# Altium schematic sheet 车架.schdoc
size 112 x 32 mm
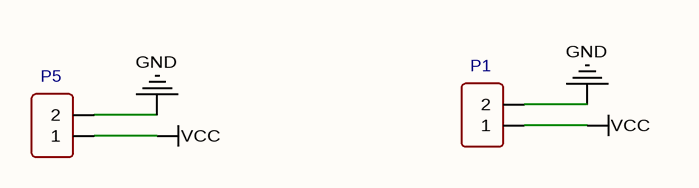
[diagram p0: 车架.schdoc]

## Parts
P1  Header-Female-2.54_1x2  [HDR-TH_2P-P2.54-V-F]  (value not drawn)
P5  Header-Female-2.54_1x2  [HDR-TH_2P-P2.54-V-F]  (value not drawn)

## Nets
GND: P1.2 P5.2
VCC: P1.1 P5.1

## Library data of the parts
P1 P5 = Header-Female-2.54_1x2: BOM_Manufacturer: BOOMELE; BOM_Manufacturer Part: 2.54-1*2PFemale; BOM_Supplier: LCSC; BOM_Supplier Part: C49661; BOM_JLCPCB Part Class: Extended Part; spicePre: P; spiceSymbolName: Header-Female-2.54_1x2